# EasyEDA Pro project PicoMiteVGAUSBV1.1.eprj, schematic Schematic1
Create Date: 2023-03-16; Page Name: P1; Project Name: PicoMiteUSB; Schematic Name: Schematic1; Update Date: 2024-02-23; Company: EasyEDA.com; Drawed: Peter Mather; Page Size: A4; Part Number: JLCPCB-002; Reviewed: Peter Mather; Version: V0.1
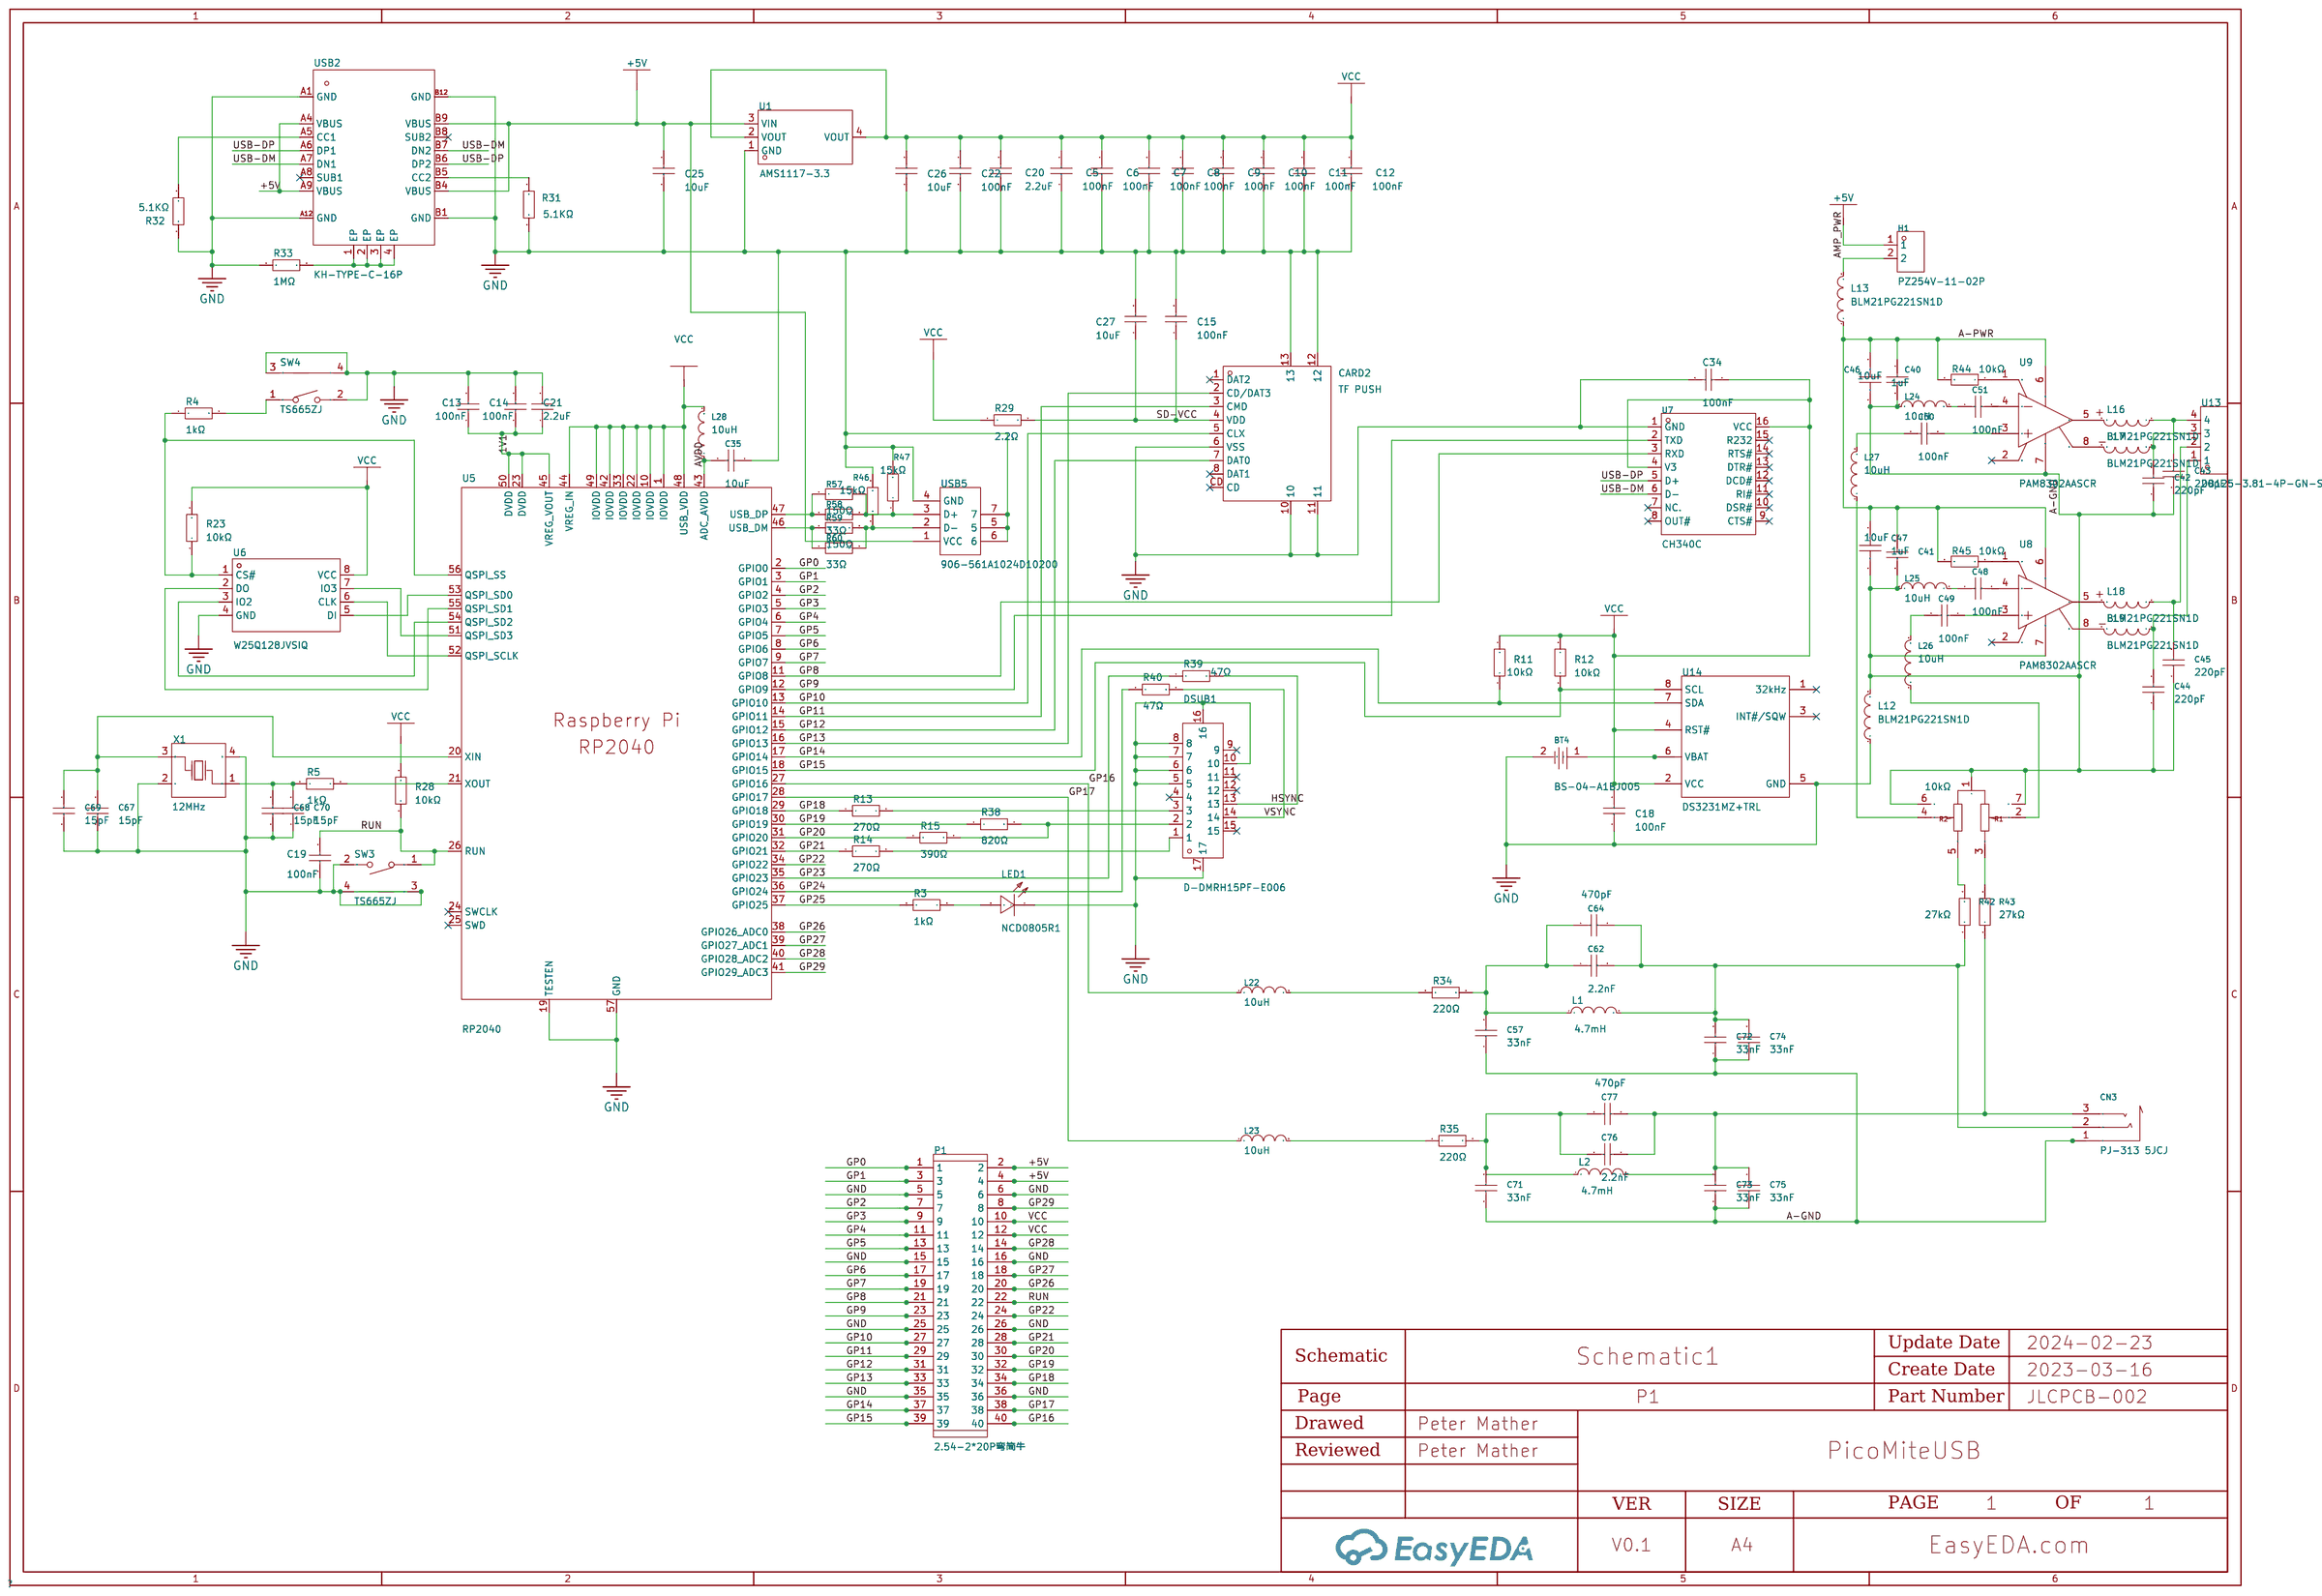
[diagram p0: schematic sheet]

## Parts
BT4  BS-04-A1BJ005  [BAT-TH_BS-04-A1BJ004]
C5  100nF  [C0402_NEW]
C6  100nF  [C0402_NEW]
C7  100nF  [C0402_NEW]
C8  100nF  [C0402_NEW]
C9  100nF  [C0402_NEW]
C10  100nF  [C0402_NEW]
C11  100nF  [C0402_NEW]
C12  100nF  [C0402_NEW]
C13  100nF  [C0402_NEW]
C14  100nF  [C0402_NEW]
C15  100nF  [C0402_NEW]
C18  100nF  [C0402_NEW]
C19  100nF  [C0402_NEW]
C20  2.2uF  [C0603]
C21  2.2uF  [C0603]
C22  100nF  [C0402_NEW]
C25  10uF  [C1206]
C26  10uF  [C1206]
C27  10uF  [C1206]
C34  100nF  [C0402_NEW]
C35  10uF  [C1206]
C40  10uF  [C1206]
C41  10uF  [C1206]
C42  220pF  [C0402]
C43  220pF  [C0402]
C44  220pF  [C0402]
C45  220pF  [C0402]
C46  1uF  [C1206]
C47  1uF  [C1206]
C48  100nF  [C0805]
C49  100nF  [C0805]
C50  100nF  [C0805]
C51  100nF  [C0805]
C57  33nF  [C0805]
C62  2.2nF  [C0805]
C64  470pF  [C0603]
C67  15pF  [C0402]
C68  15pF  [C0402]
C69  15pF  [C0402]
C70  15pF  [C0402]
C71  33nF  [C0805]
C72  33nF  [C0805]
C73  33nF  [C0805]
C74  33nF  [C0805]
C75  33nF  [C0805]
C76  2.2nF  [C0805]
C77  470pF  [C0603]
CARD2  TF PUSH  [TF-SMD_TF-PUSH]
CN3  PJ-313 5JCJ  [AUDIO-TH_PJ-313_5JCJ]
DSUB1  D-DMRH15PF-E006  [DSUB-TH_15P-P2.29-H-F_DDMRH15PFE006]
H1  PZ254V-11-02P  [HDR-TH_2P-P2.54-V-M]
L1  4.7mH  [IND-SMD_L6.0-W6.0]
L2  4.7mH  [IND-SMD_L6.0-W6.0]
L12  BLM21PG221SN1D  [L0805]
L13  BLM21PG221SN1D  [L0805]
L16  BLM21PG221SN1D  [L0805]
L17  BLM21PG221SN1D  [L0805]
L18  BLM21PG221SN1D  [L0805]
L19  BLM21PG221SN1D  [L0805]
L22  10uH  [L0805]
L23  10uH  [L0805]
L24  10uH  [L0805]
L25  10uH  [L0805]
L26  10uH  [L0805]
L27  10uH  [L0805]
L28  10uH  [L0805]
LED1  NCD0805R1  [LED0805-RD]
P1  2.54-2*20P弯简牛  [IDC-TH_40P-P2.54-C9145]
R3  1kΩ  [R0603]
R4  1kΩ  [R0603]
R5  1kΩ  [R0603]
R11  10kΩ  [R0805]
R12  10kΩ  [R0805]
R13  270Ω  [R0603]
R14  270Ω  [R0603]
R15  390Ω  [R0603]
R23  10kΩ  [R0402]
R28  10kΩ  [R0402]
R29  2.2Ω  [R0805]
R31  5.1kΩ  [R0402]
R32  5.1kΩ  [R0402]
R33  1MΩ  [R0402]
R34  220Ω  [R0603]
R35  220Ω  [R0603]
R38  820Ω  [R0603]
R39  47Ω  [R0805]
R40  47Ω  [R0805]
R42  27kΩ  [R0805]
R43  27kΩ  [R0805]
R44  10kΩ  [R0805]
R45  10kΩ  [R0805]
R46  15kΩ  [R0805]
R47  15kΩ  [R0805]
R57  150Ω  [R0603]
R58  33Ω  [R0805]
R59  150Ω  [R0603]
R60  33Ω  [R0805]
SW3  TS665ZJ  [SW-TH_TS665ZJ]
SW4  TS665ZJ  [SW-TH_TS665ZJ]
U1  AMS1117-3.3  [SOT-223-3_L6.5-W3.4-P2.30-LS7.0-BR]
U5  RP2040  [LQFN-56_L7.0-W7.0-P0.4-EP]
U6  W25Q128JVSIQ  [SOIC-8_L5.3-W5.3-P1.27-LS8.0-BL]
U7  CH340C  [SOP-16_L10.0-W3.9-P1.27-LS6.0-BL]
U8  PAM8302AASCR  [MSOP-8_L3.0-W3.0-P0.65-LS5.0-BL]
U9  PAM8302AASCR  [MSOP-8_L3.0-W3.0-P0.65-LS5.0-BL]
U13  DB125-3.81-4P-GN-S  [CONN-TH_DB125-3.81-4P]
U14  DS3231MZ+TRL  [SOIC-8_L4.9-W3.9-P1.27-LS6.0-BL]
USB2  KH-TYPE-C-16P  [USB-C-SMD_KH-TYPE-C-16P]
USB5  906-561A1024D10200  [USB-A-TH_C39450]
VR1  10kΩ  [RES-TH_RK10J12E002L]
X1  12MHz  [OSC-SMD_4P-L3.2-W2.5-BL]

## Library data of the parts
BT4 = BS-04-A1BJ005: Connector Type:Battery base Battery Type:CR2032 Operating Temperature Range:-25℃~+85℃ Operating Temperature Range:-25℃~+85℃; LCSC Part Name: 电池底座 适用电池:CR2032; Supplier Part: C964751; Manufacturer: MYOUNG(美阳); Supplier Footprint: 插件; JLCPCB Part Class: Extended Part; Datasheet: https://atta.szlcsc.com/upload/public/pdf/source/20201218/C964751_974D973689E162B6ACD63DB51B9F9202.pdf; Supplier: LCSC; Connector Type: Battery base; Battery Type: CR2032; Operating Temperature Range: -25℃~+85℃
C5-C15 C18 C19 C22 C34 = CL05B104KO5NNNC: Capacitance: Tolerance:±10% Tolerance:±10% Voltage Rated: Temperature Coefficient:; LCSC Part Name: 100nF ±10% 16V; Supplier Part: C1525; Manufacturer: SAMSUNG(三星); Supplier Footprint: 0402; JLCPCB Part Class: Basic Part; Datasheet: https://atta.szlcsc.com/upload/public/pdf/source/20160103/1457707674891.pdf; Supplier: LCSC; Tolerance: ±10%
C20 C21 = CL10A225KO8NNNC: Capacitance: Tolerance:±10% Tolerance:±10% Voltage Rated: Temperature Coefficient:; LCSC Part Name: 2.2uF ±10% 16V; Supplier Part: C23630; Manufacturer: SAMSUNG(三星); Supplier Footprint: 0603; JLCPCB Part Class: Basic Part; Datasheet: https://atta.szlcsc.com/upload/public/pdf/source/20160103/1457707709512.pdf; Supplier: LCSC; Tolerance: ±10%
C25-C27 C35 C40 C41 = CL31A106KBHNNNE: Capacitance: Tolerance:±10% Tolerance:±10% Voltage Rated: Temperature Coefficient:; LCSC Part Name: 10uF ±10% 50V; Supplier Part: C13585; Manufacturer: SAMSUNG(三星); Supplier Footprint: 1206; JLCPCB Part Class: Basic Part; Datasheet: https://atta.szlcsc.com/upload/public/pdf/source/20160103/1457707668742.pdf; Supplier: LCSC; Tolerance: ±10%
C42-C45 = 0402B221K500NT: Capacitance: Tolerance:±10% Tolerance:±10% Voltage Rated: Temperature Coefficient:; LCSC Part Name: 220pF ±10% 50V; Supplier Part: C1530; Manufacturer: FH(风华); Supplier Footprint: 0402; JLCPCB Part Class: Basic Part; Datasheet: https://atta.szlcsc.com/upload/public/pdf/source/20200305/C486355_26A10D38EF8C2A5C37091D0039909270.pdf; Supplier: LCSC; Tolerance: ±10%
C46 C47 = CL31B105KBHNNNE: Capacitance: Tolerance:±10% Tolerance:±10% Voltage Rated: Temperature Coefficient:; LCSC Part Name: 1uF ±10% 50V; Supplier Part: C1848; Manufacturer: SAMSUNG(三星); Supplier Footprint: 1206; JLCPCB Part Class: Basic Part; Datasheet: https://atta.szlcsc.com/upload/public/pdf/source/20160218/1457707763339.pdf; Supplier: LCSC; Tolerance: ±10%
C48-C51 = CC0805KRX7R9BB104: Capacitance: Tolerance:±10% Tolerance:±10% Voltage Rated: Temperature Coefficient:; LCSC Part Name: 100nF ±10% 50V; Supplier Part: C49678; Manufacturer: YAGEO(国巨); Supplier Footprint: 0805; JLCPCB Part Class: Basic Part; Datasheet: https://atta.szlcsc.com/upload/public/pdf/source/20180224/C181747_15194369449651363981.pdf; Supplier: LCSC; Tolerance: ±10%
C57 C71-C75 = 0805B333K500NT: Capacitance:33nF Tolerance:±10% Tolerance:±10% Voltage Rated: Temperature Coefficient:; LCSC Part Name: 33nF ±10% 50V; Supplier Part: C1739; Manufacturer: FH(风华); Supplier Footprint: 0805; JLCPCB Part Class: Basic Part; Datasheet: https://atta.szlcsc.com/upload/public/pdf/source/20200305/C486355_26A10D38EF8C2A5C37091D0039909270.pdf; Supplier: LCSC; Tolerance: ±10%
C62 C76 = CL21C222JBFNNNE: Capacitance: Tolerance:±5% Tolerance:±5% Voltage Rated: Temperature Coefficient:; LCSC Part Name: 2.2nF ±5% 50V; Supplier Part: C28260; Manufacturer: SAMSUNG(三星); Supplier Footprint: 0805; JLCPCB Part Class: Basic Part; Datasheet: https://atta.szlcsc.com/upload/public/pdf/source/20160218/1457707763339.pdf; Supplier: LCSC; Tolerance: ±5%
C64 C77 = 0603B471K500NT: Capacitance: Tolerance:±10% Tolerance:±10% Voltage Rated: Temperature Coefficient:; LCSC Part Name: 470pF ±10% 50V; Supplier Part: C1620; Manufacturer: FH(风华); Supplier Footprint: 0603; JLCPCB Part Class: Basic Part; Datasheet: https://atta.szlcsc.com/upload/public/pdf/source/20200305/C486355_26A10D38EF8C2A5C37091D0039909270.pdf; Supplier: LCSC; Tolerance: ±10%
C67-C70 = 0402CG150J500NT: Capacitance: Tolerance:±5% Tolerance:±5% Voltage Rated: Temperature Coefficient:; LCSC Part Name: 15pF ±5% 50V; Supplier Part: C1548; Manufacturer: FH(风华); Supplier Footprint: 0402; JLCPCB Part Class: Basic Part; Datasheet: https://atta.szlcsc.com/upload/public/pdf/source/20200305/C486355_26A10D38EF8C2A5C37091D0039909270.pdf; Supplier: LCSC; Tolerance: ±5%
CARD2 = TF PUSH: Card Type:MicroSD卡(TF卡) Connector Type:卡座 Card Connection Mode:自弹式 Maximum Body Height:2mm Operating Temperature Range:-20℃~+90℃ Operating Temperature Range:-20℃~+90℃; LCSC Part Name: 自弹式TF卡座 TF外焊式内存卡卡座; Supplier Part: C393941; Manufacturer: SHOU HAN(首韩); Supplier Footprint: SMD; JLCPCB Part Class: Extended Part; Datasheet: https://atta.szlcsc.com/upload/public/pdf/source/20191011/C393941_0DDD896EE907FEB750D8B7B8982E2A67.pdf; Supplier: LCSC; Card Type: MicroSD卡(TF卡); Connector Type: 卡座; Card Connection Mode: 自弹式; Maximum Body Height: 2mm; Operating Temperature Range: -20℃~+90℃
CN3 = PJ-313 5JCJ: Connector Type:3.5mm耳机座 Current Rating (Max):- Voltage Rating (Max):- Operating Temperature Range:-20℃~+70℃ Operating Temperature Range:-20℃~+70℃; LCSC Part Name: 3.5mm耳机座; Supplier Part: C668607; Manufacturer: SHOU HAN(首韩); Supplier Footprint: 插件; JLCPCB Part Class: Extended Part; Datasheet: https://atta.szlcsc.com/upload/public/pdf/source/20200618/C668607_FE17687B176711313D54B567644D1F03.pdf; Supplier: LCSC; Connector Type: 3.5mm耳机座; Operating Temperature Range: -20℃~+70℃
DSUB1 = D-DMRH15PF-E006: Connector Type:D-Sub Gender:Female Number of Pins:15 Number of Rows:3 Mounting Style:Shrouded Current Rating (Max):3A Operating Temperature Range:-50℃~+105℃ Operating Temperature Range:-50℃~+105℃; LCSC Part Name: D-Sub 母 P数:15 HDR半金 铆合锁螺丝 黑胶芯三排; Supplier Part: C379814; Manufacturer: Ckmtw(灿科盟); Supplier Footprint: 插件; JLCPCB Part Class: Extended Part; Datasheet: https://atta.szlcsc.com/upload/public/pdf/source/20190517/C379814_DEECC6016DAC8F179B4364792A838A7A.pdf; Supplier: LCSC; Connector Type: D-Sub; Gender: Female; Number of Pins: 15; Number of Rows: 3; Mounting Style: Shrouded; Current Rating (Max): 3A; Operating Temperature Range: -50℃~+105℃
H1 = PZ254V-11-02P: Pin Structure:1x2P Pitch:2.54mm Row Spacing:- Circluar Pins/Square Pins:Square Pins Mounting Type:Straight Number of Rows:Plugin Number of Pins:2P Current Rating (Max):- Voltage Rating (Max):- Length of Mating Pin:6mm Insulation Height:2.5mm Length of End; LCSC Part Name: 间距:2.54mm 1x2P 直插 方针; Supplier Part: C492401; Manufacturer: XFCN(兴飞); Supplier Footprint: 插件,P=2.54mm; JLCPCB Part Class: Extended Part; Datasheet: https://atta.szlcsc.com/upload/public/pdf/source/20200309/C492401_A812433581A9B211A7FFA413ADDFF0E5.pdf; Supplier: LCSC; Pin Structure: 1x2P; Pitch: 2.54mm; Circluar Pins/Square Pins: Square Pins; Mounting Type: Straight; Number of Rows: Plugin; Number of Pins: 2P; Length of Mating Pin: 6mm; Insulation Height: 2.5mm; Length of End Connection Pin: 3mm; Operating Temperature Range: -40℃~+105℃; Color: Black
L1 L2 = YNR6045-472M: Inductance: Tolerance: Tolerance: Rated Current: DC Resistance (DCR):; LCSC Part Name: 4.7mH ±20% 120mA 19.75Ω; Supplier Part: C497846; Manufacturer: YJYCOIN(益嘉源); Supplier Footprint: SMD,6x6mm; JLCPCB Part Class: Extended Part; Datasheet: https://atta.szlcsc.com/upload/public/pdf/source/20200317/C497838_ADAADDA66AFC043F2D8B9A62FB946728.pdf; Supplier: LCSC
L12 L13 L16-L19 = BLM21PG221SN1D: Impedance @ Frequency:220Ω@100MHz Tolerance:±25% Tolerance:±25% DC Resistance:45mΩ Current Rating:2A Circuits:1; LCSC Part Name: 单路 0805磁珠 阻抗220Ω@100MHz; Supplier Part: C85840; Manufacturer: muRata(村田); Supplier Footprint: 0805; JLCPCB Part Class: Extended Part; Datasheet: https://atta.szlcsc.com/upload/public/pdf/source/20180326/C118443_3FAC30E9A4F0E6B81275543C61E0685E.pdf; Supplier: LCSC; Impedance @ Frequency: 220Ω@100MHz; Tolerance: ±25%; DC Resistance: 45mΩ; Current Rating: 2A; Circuits: 1
L22-L28 = SDFL2012S100KTF: Inductance: Tolerance:±10% Tolerance:±10% Rated Current: Saturation Current (Isat):- DC Resistance (DCR): Q @ Freq:- Frequency - Self Resonant:- Ratings:; LCSC Part Name: 10uH ±10%; Supplier Part: C1046; Manufacturer: Sunlord(顺络); Supplier Footprint: 0805; JLCPCB Part Class: Basic Part; Datasheet: https://atta.szlcsc.com/upload/public/pdf/source/20231027/097A17DDB71564CE812E62F0F80142C9.pdf; Supplier: LCSC; Tolerance: ±10%
LED1 = NCD0805R1_C84256: Emitted Color:红灯; LCSC Part Name: 红灯; Supplier Part: C84256; Manufacturer: 国星光电; Supplier Footprint: 0805; JLCPCB Part Class: Basic Part; Datasheet: https://atta.szlcsc.com/upload/public/pdf/source/20200820/C84256_F0A75A43B3EAD75808600A0514C76B99.pdf; Supplier: LCSC; Emitted Color: 红灯
P1 = 2.54-2*20P弯简牛: Connector Type:简牛座 Pitch:2.54mm Structure:2x20P Holder Type:Right-Angle Row Spacing:2.54mm Number of Rows:2 Pin Number in each Row:20 Contact Material:- Contact Plating:-; LCSC Part Name: 2.54mm 2x20P 排数:2 每排P数:20; Supplier Part: C9145; Manufacturer: BOOMELE(博穆精密); Supplier Footprint: 弯插,P=2.54mm; JLCPCB Part Class: Extended Part; Datasheet: https://atta.szlcsc.com/upload/public/pdf/source/20140331/1457707038568.pdf; Supplier: LCSC; Connector Type: 简牛座; Pitch: 2.54mm; Structure: 2x20P; Holder Type: Right-Angle; Row Spacing: 2.54mm; Number of Rows: 2; Pin Number in each Row: 20
R3-R5 = 0603WAF1001T5E: Type:Thick Film Resistors Resistance: Tolerance:±1% Tolerance:±1% Power(Watts): Temperature Coefficient:±100ppm/℃ Temperature Coefficient:±100ppm/℃ Overload Voltage (Max): Operating Temperature Range:-55℃~+155℃ Operating Temperature Range:-55℃~+155℃; LCSC Part Name: 1kΩ ±1% 100mW; Supplier Part: C21190; Manufacturer: UNI-ROYAL(厚声); Supplier Footprint: 0603; JLCPCB Part Class: Basic Part; Datasheet: https://atta.szlcsc.com/upload/public/pdf/source/20200306/C422600_1E6D84923E4A46A82E41ADD87F860B5C.pdf; Supplier: LCSC; Type: Thick Film Resistors; Tolerance: ±1%; Temperature Coefficient: ±100ppm/℃; Operating Temperature Range: -55℃~+155℃
R11 R12 R44 R45 = 0805W8F1002T5E: Type:Thick Film Resistors Resistance: Tolerance:±1% Tolerance:±1% Power(Watts): Temperature Coefficient:±100ppm/℃ Temperature Coefficient:±100ppm/℃ Overload Voltage (Max): Operating Temperature Range:-55℃~+155℃ Operating Temperature Range:-55℃~+155℃; LCSC Part Name: 10kΩ ±1% 125mW; Supplier Part: C17414; Manufacturer: UNI-ROYAL(厚声); Supplier Footprint: 0805; JLCPCB Part Class: Basic Part; Datasheet: https://atta.szlcsc.com/upload/public/pdf/source/20200306/C422600_1E6D84923E4A46A82E41ADD87F860B5C.pdf; Supplier: LCSC; Type: Thick Film Resistors; Tolerance: ±1%; Temperature Coefficient: ±100ppm/℃; Operating Temperature Range: -55℃~+155℃
R13 R14 = 0603WAF2700T5E: Type:Thick Film Resistors Resistance: Tolerance:±1% Tolerance:±1% Power(Watts): Temperature Coefficient:±100ppm/℃ Temperature Coefficient:±100ppm/℃ Overload Voltage (Max): Operating Temperature Range:-55℃~+155℃ Operating Temperature Range:-55℃~+155℃; LCSC Part Name: 270Ω ±1% 100mW; Supplier Part: C22966; Manufacturer: UNI-ROYAL(厚声); Supplier Footprint: 0603; JLCPCB Part Class: Basic Part; Datasheet: https://atta.szlcsc.com/upload/public/pdf/source/20200306/C422600_1E6D84923E4A46A82E41ADD87F860B5C.pdf; Supplier: LCSC; Type: Thick Film Resistors; Tolerance: ±1%; Temperature Coefficient: ±100ppm/℃; Operating Temperature Range: -55℃~+155℃
R15 = 0603WAF3900T5E: Tolerance: Temperature Coefficient: Temperature Coefficient: Power(Watts): Resistance: Overload Voltage (Max): Operating Temperature Range: Operating Temperature Range:; LCSC Part Name: 390Ω ±1%; Supplier Part: C23151; Manufacturer: UNI-ROYAL(厚声); Supplier Footprint: 0603; JLCPCB Part Class: Basic Part; Datasheet: https://atta.szlcsc.com/upload/public/pdf/source/20170920/C23151_1505901103965982535.pdf; Supplier: LCSC
R23 R28 = 0402WGF1002TCE: Type:Thick Film Resistors Resistance: Tolerance:±1% Tolerance:±1% Power(Watts): Temperature Coefficient:±100ppm/℃ Temperature Coefficient:±100ppm/℃ Overload Voltage (Max): Operating Temperature Range:-55℃~+155℃ Operating Temperature Range:-55℃~+155℃; LCSC Part Name: 10kΩ ±1% 62.5mW; Supplier Part: C25744; Manufacturer: UNI-ROYAL(厚声); Supplier Footprint: 0402; JLCPCB Part Class: Basic Part; Datasheet: https://atta.szlcsc.com/upload/public/pdf/source/20200306/C422600_1E6D84923E4A46A82E41ADD87F860B5C.pdf; Supplier: LCSC; Type: Thick Film Resistors; Tolerance: ±1%; Temperature Coefficient: ±100ppm/℃; Operating Temperature Range: -55℃~+155℃
R29 = 0805W8F220KT5E: LCSC Part Name: 2.2Ω(2R20) ±1% 编带; Supplier Part: C17521; Manufacturer: UNI-ROYAL(厚声); Supplier Footprint: 0805; JLCPCB Part Class: Basic Part; Datasheet: https://atta.szlcsc.com/upload/public/pdf/source/20170920/C17521_1505887118343979880.pdf; Supplier: LCSC
R31 R32 = 0402WGF5101TCE: Type:Thick Film Resistors Resistance: Tolerance:±1% Tolerance:±1% Power(Watts): Temperature Coefficient:±100ppm/℃ Temperature Coefficient:±100ppm/℃ Overload Voltage (Max): Operating Temperature Range:-55℃~+155℃ Operating Temperature Range:-55℃~+155℃; LCSC Part Name: 5.1KΩ(5101) ±1% 编带; Supplier Part: C25905; Manufacturer: UNI-ROYAL(厚声); Manufacturer Part: 5.1KΩ; Supplier Footprint: 0402; JLCPCB Part Class: Basic Part; Datasheet: https://atta.szlcsc.com/upload/public/pdf/source/20170920/C25905_1505895107382980911.pdf; Supplier: LCSC; Type: Thick Film Resistors; Tolerance: ±1%; Temperature Coefficient: ±100ppm/℃; Operating Temperature Range: -55℃~+155℃
R33 = 0402WGF1004TCE: Type:Thick Film Resistors Resistance: Tolerance:±1% Tolerance:±1% Power(Watts): Temperature Coefficient:±100ppm/℃ Temperature Coefficient:±100ppm/℃ Overload Voltage (Max): Operating Temperature Range:-55℃~+155℃ Operating Temperature Range:-55℃~+155℃; LCSC Part Name: 1MΩ ±1% 62.5mW; Supplier Part: C26083; Manufacturer: UNI-ROYAL(厚声); Supplier Footprint: 0402; JLCPCB Part Class: Basic Part; Datasheet: https://atta.szlcsc.com/upload/public/pdf/source/20200306/C422600_1E6D84923E4A46A82E41ADD87F860B5C.pdf; Supplier: LCSC; Type: Thick Film Resistors; Tolerance: ±1%; Temperature Coefficient: ±100ppm/℃; Operating Temperature Range: -55℃~+155℃
R34 R35 = 0603WAF2200T5E: Type:Thick Film Resistors Resistance: Tolerance:±1% Tolerance:±1% Power(Watts): Temperature Coefficient:±100ppm/℃ Temperature Coefficient:±100ppm/℃ Overload Voltage (Max): Operating Temperature Range:-55℃~+155℃ Operating Temperature Range:-55℃~+155℃; LCSC Part Name: 220Ω ±1% 100mW; Supplier Part: C22962; Manufacturer: UNI-ROYAL(厚声); Supplier Footprint: 0603; JLCPCB Part Class: Basic Part; Datasheet: https://atta.szlcsc.com/upload/public/pdf/source/20200306/C422600_1E6D84923E4A46A82E41ADD87F860B5C.pdf; Supplier: LCSC; Type: Thick Film Resistors; Tolerance: ±1%; Temperature Coefficient: ±100ppm/℃; Operating Temperature Range: -55℃~+155℃
R38 = 0603WAF8200T5E: Type:Thick Film Resistors Resistance: Tolerance:±1% Tolerance:±1% Power(Watts): Temperature Coefficient:±100ppm/℃ Temperature Coefficient:±100ppm/℃ Overload Voltage (Max): Operating Temperature Range:-55℃~+155℃ Operating Temperature Range:-55℃~+155℃; LCSC Part Name: 820Ω ±1% 100mW; Supplier Part: C23253; Manufacturer: UNI-ROYAL(厚声); Supplier Footprint: 0603; JLCPCB Part Class: Basic Part; Datasheet: https://atta.szlcsc.com/upload/public/pdf/source/20200306/C422600_1E6D84923E4A46A82E41ADD87F860B5C.pdf; Supplier: LCSC; Type: Thick Film Resistors; Tolerance: ±1%; Temperature Coefficient: ±100ppm/℃; Operating Temperature Range: -55℃~+155℃
R39 R40 = 0805W8F470JT5E: Type:Thick Film Resistors Resistance: Tolerance:±1% Tolerance:±1% Power(Watts): Temperature Coefficient:±200ppm/℃ Temperature Coefficient:±200ppm/℃ Overload Voltage (Max): Operating Temperature Range:-55℃~+155℃ Operating Temperature Range:-55℃~+155℃; LCSC Part Name: 47Ω ±1% 125mW; Supplier Part: C17714; Manufacturer: UNI-ROYAL(厚声); Supplier Footprint: 0805; JLCPCB Part Class: Basic Part; Datasheet: https://atta.szlcsc.com/upload/public/pdf/source/20200306/C422600_1E6D84923E4A46A82E41ADD87F860B5C.pdf; Supplier: LCSC; Type: Thick Film Resistors; Tolerance: ±1%; Temperature Coefficient: ±200ppm/℃; Operating Temperature Range: -55℃~+155℃
R42 R43 = 0805W8F2702T5E: Resistance:27000Ω Tolerance:±1% Tolerance:±1% Power(Watts): Overload Voltage (Max): Temperature Coefficient:±100ppm/℃ Temperature Coefficient:±100ppm/℃ Type:Thick Film Resistors Operating Temperature Range:-55℃~+155℃ Operating Temperature Range:-55℃~+155℃; LCSC Part Name: 27kΩ ±1% 125mW 厚膜电阻; Supplier Part: C17593; Manufacturer: UNI-ROYAL(厚声); Supplier Footprint: 0805; JLCPCB Part Class: Basic Part; Datasheet: https://atta.szlcsc.com/upload/public/pdf/source/20200306/C422600_1E6D84923E4A46A82E41ADD87F860B5C.pdf; Supplier: LCSC; Tolerance: ±1%; Temperature Coefficient: ±100ppm/℃; Type: Thick Film Resistors; Operating Temperature Range: -55℃~+155℃
R46 R47 = 0805W8F1502T5E: Resistance:15000Ω Tolerance:±1% Tolerance:±1% Power(Watts): Overload Voltage (Max): Temperature Coefficient:±100ppm/℃ Temperature Coefficient:±100ppm/℃ Type:Thick Film Resistors Operating Temperature Range:-55℃~+155℃ Operating Temperature Range:-55℃~+155℃; LCSC Part Name: 15kΩ ±1% 125mW 厚膜电阻; Supplier Part: C17475; Manufacturer: UNI-ROYAL(厚声); Supplier Footprint: 0805; JLCPCB Part Class: Basic Part; Datasheet: https://atta.szlcsc.com/upload/public/pdf/source/20200306/C422600_1E6D84923E4A46A82E41ADD87F860B5C.pdf; Supplier: LCSC; Tolerance: ±1%; Temperature Coefficient: ±100ppm/℃; Type: Thick Film Resistors; Operating Temperature Range: -55℃~+155℃
R57 R59 = 0603WAF1500T5E: Type:Thick Film Resistors Resistance: Tolerance:±1% Tolerance:±1% Power(Watts): Overload Voltage (Max): Temperature Coefficient:±100ppm/℃ Temperature Coefficient:±100ppm/℃ Operating Temperature Range:-55℃~+155℃ Operating Temperature Range:-55℃~+155℃; LCSC Part Name: 150Ω ±1% 100mW 厚膜电阻; Supplier Part: C22808; Manufacturer: UNI-ROYAL(厚声); Supplier Footprint: 0603; JLCPCB Part Class: Basic Part; Datasheet: https://atta.szlcsc.com/upload/public/pdf/source/20200306/C422600_1E6D84923E4A46A82E41ADD87F860B5C.pdf; Supplier: LCSC; Type: Thick Film Resistors; Tolerance: ±1%; Temperature Coefficient: ±100ppm/℃; Operating Temperature Range: -55℃~+155℃
R58 R60 = 0805W8F330JT5E: Type:Thick Film Resistors Resistance:33Ω Tolerance:±1% Tolerance:±1% Power(Watts): Overload Voltage (Max): Temperature Coefficient:±200ppm/℃ Temperature Coefficient:±200ppm/℃ Operating Temperature Range:-55℃~+155℃ Operating Temperature Range:-55℃~+155℃; LCSC Part Name: 33Ω ±1% 125mW 厚膜电阻; Supplier Part: C17634; Manufacturer: UNI-ROYAL(厚声); Supplier Footprint: 0805; JLCPCB Part Class: Basic Part; Datasheet: https://atta.szlcsc.com/upload/public/pdf/source/20200306/C422600_1E6D84923E4A46A82E41ADD87F860B5C.pdf; Supplier: LCSC; Type: Thick Film Resistors; Tolerance: ±1%; Temperature Coefficient: ±200ppm/℃; Operating Temperature Range: -55℃~+155℃
SW3 SW4 = TS665ZJ: Contact Current:50mA Voltage Rating (DC):12V Insulation Resistance:100MΩ Circuit:SPST Mounting Style:Lying Actuator Style:Round Button Actuator/Cap Color:Black Operating Force:250gf@±30gf Mechanical Life:50000次 Pin Style:PCPin Switch Length:6.2mm Switch W; LCSC Part Name: 6.2*6.2*5mm 卧插 轻触开关; Supplier Part: C557599; Manufacturer: SHOU HAN(首韩); Supplier Footprint: 插件; JLCPCB Part Class: Extended Part; Datasheet: https://atta.szlcsc.com/upload/public/pdf/source/20200519/C557599_C93058E34E1879225DC935A3AAEF7EAA.pdf; Supplier: LCSC; Contact Current: 50mA; Voltage Rating (DC): 12V; Insulation Resistance: 100MΩ; Circuit: SPST; Mounting Style: Lying; Actuator Style: Round Button; Actuator/Cap Color: Black; Operating Force: 250gf@±30gf; Mechanical Life: 50000次; Pin Style: PCPin; Switch Length: 6.2mm; Switch Width: 6.2mm; Switch Height: 5mm; Strike Gundam: Yes
U1 = AMS1117-3.3_C6186: Output Type: Output Polarity:Positive Number of Outputs:1 Maximum Input Voltage:- Output Voltage:3.3V~3.3V Output Voltage:3.3V~3.3V Dropout Voltage:1.3V@(800mA) Quiescent Current (Ground Current):- Output Current:1A Power Supply Rejection Ratio (PSRR):72d; LCSC Part Name: 正 Vout=3.3V 1A 72dB@(120Hz); Supplier Part: C6186; Manufacturer: AMS; Supplier Footprint: SOT-223-3; JLCPCB Part Class: Basic Part; Datasheet: https://atta.szlcsc.com/upload/public/pdf/source/20180727/C6186_7A095716F0823C02F1997A905E26C086.pdf; Supplier: LCSC; Output Polarity: Positive; Number of Outputs: 1; Output Voltage: 3.3V~3.3V; Dropout Voltage: 1.3V@(800mA); Output Current: 1A; Power Supply Rejection Ratio (PSRR): 72dB@(120Hz)
U5 = RP2040_C2040: CPU Core:ARM Cortex-M0 CPU Maximum Speed:133MHz Operating Voltage Range:- Operating Voltage Range:- Program Storage Size:- Program Memory Type:- RAM Size:264KB EEPROM:- GPIO Ports Number:30 ADC (Bit):12bit DAC (Bit):- PWM (Bit):- 8Bit Timer:- 16Bit Timer:; LCSC Part Name: ARM Cortex-M0 133MHz; Supplier Part: C2040; Manufacturer: Raspberry Pi(树莓派); Supplier Footprint: LQFN-56(7x7); JLCPCB Part Class: Extended Part; Datasheet: https://atta.szlcsc.com/upload/public/pdf/source/20210621/C2040_96F425825606B7957D87DD32E2512CA9.pdf; Supplier: LCSC; CPU Core: ARM Cortex-M0; CPU Maximum Speed: 133MHz; RAM Size: 264KB; GPIO Ports Number: 30; ADC (Bit): 12bit; UART/USART: 2; I2C: 2; SPI: 2; Universal Serial Bus: 有; Peripheral/Function: DMA；PWM; Direct Memory Access: 有
U6 = W25Q128JVSIQ: Supplier Part: C97521; Manufacturer: WINBOND(华邦); Supplier Footprint: SOIC-8-208mil; JLCPCB Part Class: Basic Part; Datasheet: https://atta.szlcsc.com/upload/public/pdf/source/20170316/1489627409956.pdf; Supplier: LCSC
U7 = CH340C: Applications Function:Transceiver Protocol: Data Rate:2Mbps Supply Voltage:3.3V；5V Supply Voltage:3.3V；5V; LCSC Part Name: CH340C USB转串口芯片 CH340; Supplier Part: C84681; Manufacturer: WCH(南京沁恒); Supplier Footprint: SOP-16; JLCPCB Part Class: Extended Part; Datasheet: https://atta.szlcsc.com/upload/public/pdf/source/20200819/C84681_ADBED554CE321879DBD6B1D06488689C.pdf; Supplier: LCSC; Applications Function: Transceiver; Data Rate: 2Mbps; Supply Voltage: 3.3V；5V
U8 U9 = PAM8302AASCR: Type of Power Amplifier: Speaker Channels:1Channel(单声道) Output Power: Supply Voltage:2V~5.5V Supply Voltage:2V~5.5V; LCSC Part Name: 2.5W单声道D类音频功率放大器 -; Supplier Part: C113367; Manufacturer: DIODES(美台); Supplier Footprint: MSOP-8; JLCPCB Part Class: Extended Part; Datasheet: https://atta.szlcsc.com/upload/public/pdf/source/20170606/1496716410034.pdf; Supplier: LCSC; Speaker Channels: 1Channel(单声道); Supply Voltage: 2V~5.5V
U13 = DB125-3.81-4P-GN-S: Structure:1x4P Pitch:3.81mm Color:Green Mounting Style:Straight Current Rating (Max):10A Voltage Rating (Max):300V Number of Pins:4P Number of Rows:1 Wire Gauge - AWG:16~26 Wire Gauge - AWG:16~26 Wire Gauge - mm2:0.5~1 Wire Gauge - mm2:0.5~1 Number of PIN; LCSC Part Name: 3.81mm 1x4P 排数:1 每排P数:4 直插; Supplier Part: C395880; Manufacturer: DORABO(地博电气); Supplier Footprint: 插件,P=3.81mm; JLCPCB Part Class: Extended Part; Datasheet: https://atta.szlcsc.com/upload/public/pdf/source/20220823/CB89165D0F406880B925A92BEEA3FB50.pdf; Supplier: LCSC; Structure: 1x4P; Pitch: 3.81mm; Color: Green; Mounting Style: Straight; Current Rating (Max): 10A; Voltage Rating (Max): 300V; Number of Pins: 4P; Number of Rows: 1; Wire Gauge - AWG: 16~26; Wire Gauge - mm2: 0.5~1; Number of PINs Per Row: 4; Operating Temperature Range: -40℃~+105℃
U14 = DS3231MZ+TRL: LCSC Part Name: DS3231MZRL; Supplier Part: C107410; Manufacturer: MAXIM(美信); Supplier Footprint: SOIC-8-150mil; JLCPCB Part Class: Extended Part; Datasheet: https://atta.szlcsc.com/upload/public/pdf/source/20170620/1497944726830.pdf; Supplier: LCSC
USB2 = KH-TYPE-C-16P: Connector Type:Type-C Standard:- Gender:Female Number of Contacts:16 Number of Ports:1 Mounting Style:Surface Mount Current Rating - Power (Max):3A Operating Temperature Range:-40℃~+85℃ Operating Temperature Range:-40℃~+85℃; LCSC Part Name: Type-C 母座 卧贴; Supplier Part: C709357; Manufacturer: kinghelm(金航标); Supplier Footprint: SMD; JLCPCB Part Class: Extended Part; Datasheet: https://atta.szlcsc.com/upload/public/pdf/source/20200911/C709357_AA8DCEB38BB20E3035A7ED7AE7667837.pdf; Supplier: LCSC; Connector Type: Type-C; Gender: Female; Number of Contacts: 16; Number of Ports: 1; Mounting Style: Surface Mount; Current Rating - Power (Max): 3A; Operating Temperature Range: -40℃~+85℃
USB5 = 906-561A1024D10200: Connector Type:Type-A Standard:USB 2.0 Gender:Female Number of Contacts:4P Number of Ports:1 Current Rating - Power (Max):2A; LCSC Part Name: Type-A 母; Supplier Part: C39450; Manufacturer: 精拓金; Supplier Footprint: 插件; JLCPCB Part Class: Extended Part; Datasheet: https://atta.szlcsc.com/upload/public/pdf/source/20210226/C39450_2D6F30D8D729109C5FFFB41256B06442.pdf; Supplier: LCSC; Connector Type: Type-A; Standard: USB 2.0; Gender: Female; Number of Contacts: 4P; Number of Ports: 1; Current Rating - Power (Max): 2A
VR1 = RK10J12E002L: Resistance: Tolerance:±30% Tolerance:±30%; LCSC Part Name: 10kΩ ±30%; Supplier Part: C231765; Manufacturer: ALPSALPINE(阿尔卑斯阿尔派); Supplier Footprint: 插件; JLCPCB Part Class: Extended Part; Datasheet: https://atta.szlcsc.com/upload/public/pdf/source/20180613/C231765_5ABC73326D205741149992123112B9D8.pdf; Supplier: LCSC; Tolerance: ±30%
X1 = X322512MSB4SI: Crystal Type:SMD Crystal Resonator Frequency: Frequency Tolerance:±10ppm Frequency Tolerance:±10ppm Frequency Stability:±30ppm Frequency Stability:±30ppm Load Capacitance: Operating Temperature: Operating Temperature:; LCSC Part Name: 12MHz ±10ppm 20pF; Supplier Part: C9002; Manufacturer: YXC(扬兴晶振); Supplier Footprint: SMD3225-4P; JLCPCB Part Class: Basic Part; Datasheet: https://atta.szlcsc.com/upload/public/pdf/source/20210329/C112971_1F611BDC486E193C1706F6D8EB5AA189.pdf; Supplier: LCSC; Crystal Type: SMD Crystal Resonator; Frequency Tolerance: ±10ppm; Frequency Stability: ±30ppm

## Nets
1V1: C13.1 C14.1 C21.1 U5.23(DVDD) U5.45(VREG_VOUT) U5.50(DVDD)
+5V: C25.2 H1.1 P1.2 P1.4 U1.3(VIN) USB2.A4(VBUS) USB2.A9(VBUS) USB2.B4(VBUS) USB2.B9(VBUS) USB5.1(VCC)
AVDD: C35.2 L28.1 U5.43(ADC_AVDD)
GND: BT4.2 C5.1 C6.1 C7.1 C8.1 C9.1 C10.1 C11.1 C12.1 C13.2 C14.2 C15.2 C18.1 C19.1 C20.1 C21.2 C22.1 C25.1 C26.1 C27.2 C34.2 C35.1 C67.1 C68.1 C69.1 C70.1 CARD2.6(VSS) CARD2.10 CARD2.11 CARD2.12 CARD2.13 DSUB1.5 DSUB1.6 DSUB1.7 DSUB1.8 DSUB1.10 DSUB1.16 DSUB1.17 L12.1 LED1.1(-) P1.5 P1.6 P1.15 P1.16 P1.25 P1.26 P1.35 P1.36 R31.1 R32.1 R33.1 R46.2 R47.2 SW3.2 SW3.3 SW3.4 SW4.2 SW4.3 SW4.4 U1.1(GND) U5.19(TESTEN) U5.57(GND) U6.4(GND) U7.1(GND) U14.5(GND) USB2.A1(GND) USB2.A12(GND) USB2.B1(GND) USB2.B12(GND) USB5.4(GND) USB5.5 USB5.6 USB5.7 X1.2(GND) X1.4(GND)
VCC: C5.2 C6.2 C7.2 C8.2 C9.2 C10.2 C11.2 C12.2 C18.2 C20.2 C22.2 C26.2 C34.1 L28.2 P1.10 P1.12 R11.2 R12.2 R23.2 R28.2 R29.1 U1.2(VOUT) U1.4(VOUT) U5.1(IOVDD) U5.10(IOVDD) U5.22(IOVDD) U5.33(IOVDD) U5.42(IOVDD) U5.44(VREG_IN) U5.48(USB_VDD) U5.49(IOVDD) U6.8(VCC) U7.4(V3) U7.16(VCC) U14.2(VCC) U14.4(RST#)
A-GND: C40.2 C41.2 C42.1 C43.1 C44.1 C45.1 C46.1 C47.1 C57.1 C71.1 C72.1 C73.1 C74.1 C75.1 CN3.1 L12.2 L24.1 L25.1 U8.7(GND) U9.7(GND) VR1.1 VR1.6(EH) VR1.7(EH)
A-PWR: C40.1 C41.1 C46.2 C47.2 L13.1 R44.2 R45.2 U8.6(VDD) U9.6(VDD)
AMP_PWR: H1.2 L13.2
GP0: P1.1 U5.2(GPIO0)
GP1: P1.3 U5.3(GPIO1)
GP2: P1.7 U5.4(GPIO2)
GP3: P1.9 U5.5(GPIO3)
GP4: P1.11 U5.6(GPIO4)
GP5: P1.13 U5.7(GPIO5)
GP6: P1.17 U5.8(GPIO6)
GP7: P1.19 U5.9(GPIO7)
GP8: P1.21 U5.11(GPIO8) U7.3(RXD)
GP9: P1.23 U5.12(GPIO9) U7.2(TXD)
GP10: CARD2.5(CLX) P1.27 U5.13(GPIO10)
GP11: CARD2.3(CMD) P1.29 U5.14(GPIO11)
GP12: CARD2.7(DAT0) P1.31 U5.15(GPIO12)
GP13: CARD2.2(CD/DAT3) P1.33 U5.16(GPIO13)
GP14: P1.37 R11.1 U5.17(GPIO14) U14.7(SDA)
GP15: P1.39 R12.1 U5.18(GPIO15) U14.8(SCL)
GP16: L22.1 P1.40 U5.27(GPIO16)
GP17: L23.1 P1.38 U5.28(GPIO17)
GP18: P1.34 R13.1 U5.29(GPIO18)
GP19: P1.32 R38.1 U5.30(GPIO19)
GP20: P1.30 R15.1 U5.31(GPIO20)
GP21: P1.28 R14.1 U5.32(GPIO21)
GP22: P1.24 U5.34(GPIO22)
GP23: R39.1 U5.35(GPIO23)
GP24: R40.1 U5.36(GPIO24)
GP25: R3.1 U5.37(GPIO25)
GP26: P1.20 U5.38(GPIO26_ADC0)
GP27: P1.18 U5.39(GPIO27_ADC1)
GP28: P1.14 U5.40(GPIO28_ADC2)
GP29: P1.8 U5.41(GPIO29_ADC3)
HSYNC: DSUB1.13 R39.2
RUN: C19.2 P1.22 R28.1 SW3.1 U5.26(RUN)
SD-VCC: C15.1 C27.1 CARD2.4(VDD) R29.2
USB-DM: U7.6(D-) USB2.A7(DN1) USB2.B7(DN2)
USB-DP: U7.5(D+) USB2.A6(DP1) USB2.B6(DP2)
VSYNC: DSUB1.14 R40.2
$1N16226: DSUB1.2 R15.2 R38.2
$1N16303: DSUB1.3 R13.2
$1N16324: DSUB1.1 R14.2
$1N17160: U5.52(QSPI_SCLK) U6.6(CLK)
$1N17190: U5.51(QSPI_SD3) U6.7(IO3)
$1N17220: U5.54(QSPI_SD2) U6.3(IO2)
$1N17286: U5.55(QSPI_SD1) U6.2(DO)
$1N17350: R4.1 R23.1 U5.56(QSPI_SS) U6.1(CS#)
$1N17556: U5.53(QSPI_SD0) U6.5(DI)
$1N17761: R5.2 U5.21(XOUT)
$1N25166: LED1.2(+) R3.2
$1N89274: R31.2 USB2.B5(CC2)
$1N89558: R32.2 USB2.A5(CC1)
$1N90266: R33.2 USB2.1(EP) USB2.2(EP) USB2.3(EP) USB2.4(EP)
$1N149316: BT4.1 U14.6(VBAT)
$1N153138: R42.2 VR1.5
$1N153144: R43.2 VR1.3
$1N153495: C51.2 U9.4(IN-)
$1N153498: C50.2 U9.3(IN+)
$1N153501: C48.2 U8.4(IN-)
$1N153504: C49.2 U8.3(IN+)
$1N153940: R44.1 U9.1(SD#)
$1N153979: R45.1 U8.1(SD#)
$1N157558: R4.2 SW4.1
$1N174548: C51.1 L24.2
$1N174627: C48.1 L25.2
$1N175144: L22.2 R34.1
$1N175189: L23.2 R35.1
$1N177798: L16.2 U9.5(VO+)
$1N177837: L17.2 U9.8(VO-)
$1N177874: L18.2 U8.5(VO+)
$1N177913: L19.2 U8.8(VO-)
$1N177952: L27.1 VR1.4
$1N177953: C50.1 L27.2
$1N177995: C49.1 L26.2
$1N177996: L26.1 VR1.2
$1N185446: C68.2 C70.2 R5.1 X1.1(OSC1)
$1N185458: C67.2 C69.2 U5.20(XIN) X1.3(OSC2)
$1N185779: C62.2 C64.2 C72.2 C74.2 CN3.2 L1.2 R42.1
$1N185780: C57.2 C62.1 C64.1 L1.1 R34.2
$1N185905: C73.2 C75.2 C76.2 C77.2 CN3.3 L2.2 R43.1
$1N185906: C71.2 C76.1 C77.1 L2.1 R35.2
$1N188762: R47.1 R57.2 R58.2 USB5.3(D+)
$1N188763: R57.1 R58.1 U5.47(USB_DP)
$1N188841: R46.1 R59.2 R60.2 USB5.2(D-)
$1N188842: R59.1 R60.1 U5.46(USB_DM)
$1N189613: C43.2 L16.1 U13.4
$1N189618: C42.2 L17.1 U13.3
$1N189623: C45.2 L18.1 U13.2
$1N189653: C44.2 L19.1 U13.1

Not connected (* = marked no-connect by the designer): CARD2 1(DAT2)* 8(DAT1)* CD*; DSUB1 4* 9* 11* 12* 15*; U5 24(SWCLK)* 25(SWD)*; U7 7(NC.)* 8(OUT#)* 9(CTS#)* 10(DSR#)* 11(RI#)* 12(DCD#)* 13(DTR#)* 14(RTS#)* 15(R232)*; U8 2(NC)*; U9 2(NC)*; U14 1(32kHz)* 3(INT#/SQW)*; USB2 A8(SUB1)* B8(SUB2)*
